# Altium schematic sheet display_dvd_connectors.SchDoc
size A4
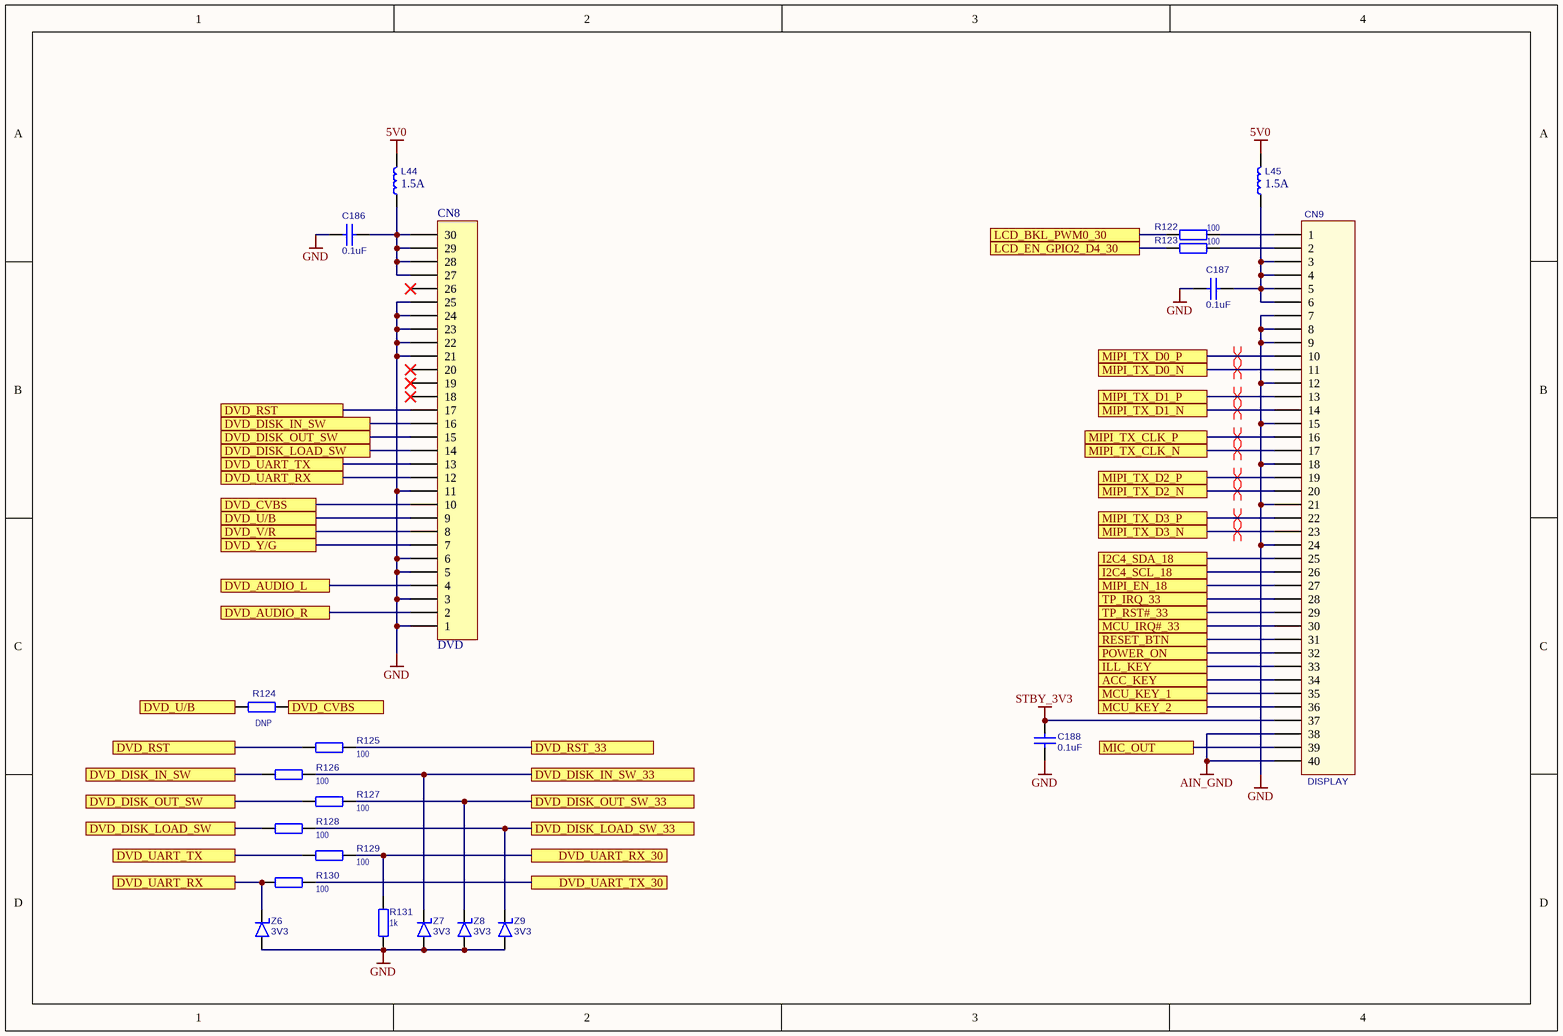
[diagram p0: display_dvd_connectors.SchDoc]

## Parts
C186  value 0.1uF  [C0603]  (hidden comment: C1608X7R1H104K080AA)
C187  value 0.1uF  [C0603]  (hidden comment: C1608X7R1H104K080AA)
C188  value 0.1uF  [C0603]  (hidden comment: C1608X7R1H104K080AA)
CN8  DVD  [30S-0.5SH]
CN9  DISPLAY  [40S-0.5SH]
L44  value 1.5A  [IND1206]  (hidden comment: BLM31PG601SN1L)
L45  value 1.5A  [IND1206]  (hidden comment: BLM31PG601SN1L)
R122  100  [R0603]
R123  100  [R0603]
R124  DNP  [R0603]
R125  100  [R0603]
R126  100  [R0603]
R127  100  [R0603]
R128  100  [R0603]
R129  100  [R0603]
R130  100  [R0603]
R131  1k  [R0603]
Z6  value 3V3  [SOD-323]  (hidden comment: BZX384-C3V3.115)
Z7  value 3V3  [SOD-323]  (hidden comment: BZX384-C3V3.115)
Z8  value 3V3  [SOD-323]  (hidden comment: BZX384-C3V3.115)
Z9  value 3V3  [SOD-323]  (hidden comment: BZX384-C3V3.115)

## Ports
ACC_KEY, DVD_AUDIO_L, DVD_AUDIO_R, DVD_CVBS, DVD_DISK_IN_SW, DVD_DISK_IN_SW_33, DVD_DISK_LOAD_SW, DVD_DISK_LOAD_SW_33, DVD_DISK_OUT_SW, DVD_DISK_OUT_SW_33, DVD_RST, DVD_RST_33, DVD_U/B, DVD_UART_RX, DVD_UART_RX_30, DVD_UART_TX, DVD_UART_TX_30, DVD_V/R, DVD_Y/G, I2C4_SCL_18, I2C4_SDA_18, ILL_KEY, LCD_BKL_PWM0_30, LCD_EN_GPIO2_D4_30, MCU_IRQ#_33, MCU_KEY_1, MCU_KEY_2, MIC_OUT, MIPI_EN_18, MIPI_TX_CLK_N, MIPI_TX_CLK_P, MIPI_TX_D0_N, MIPI_TX_D0_P, MIPI_TX_D1_N, MIPI_TX_D1_P, MIPI_TX_D2_N, MIPI_TX_D2_P, MIPI_TX_D3_N, MIPI_TX_D3_P, POWER_ON, RESET_BTN, TP_IRQ_33, TP_RST#_33

## Nets
5V0: L44.2 L45.2
AIN_GND: CN9.38 CN9.40
GND: C186.1 C187.1 C188.1 CN8.1 CN8.3 CN8.5 CN8.6 CN8.11 CN8.21 CN8.22 CN8.23 CN8.24 CN8.25 CN9.7 CN9.8 CN9.9 CN9.12 CN9.15 CN9.18 CN9.21 CN9.24 R131.2 Z6.1(A) Z7.1(A) Z8.1(A) Z9.1(A)
STBY_3V3: C188.2 CN9.37
ACC_KEY: CN9.34 ; port ACC_KEY
DVD_AUDIO_L: CN8.4 ; port DVD_AUDIO_L
DVD_AUDIO_R: CN8.2 ; port DVD_AUDIO_R
DVD_CVBS: CN8.10 R124.1 ; port DVD_CVBS
DVD_DISK_IN_SW: CN8.16 R126.2 ; port DVD_DISK_IN_SW
DVD_DISK_IN_SW_33: R126.1 Z7.2(K) ; port DVD_DISK_IN_SW_33
DVD_DISK_LOAD_SW: CN8.14 R128.2 ; port DVD_DISK_LOAD_SW
DVD_DISK_LOAD_SW_33: R128.1 Z9.2(K) ; port DVD_DISK_LOAD_SW_33
DVD_DISK_OUT_SW: CN8.15 R127.2 ; port DVD_DISK_OUT_SW
DVD_DISK_OUT_SW_33: R127.1 Z8.2(K) ; port DVD_DISK_OUT_SW_33
DVD_RST: CN8.17 R125.2 ; port DVD_RST
DVD_RST_33: R125.1 ; port DVD_RST_33
DVD_U/B: CN8.9 R124.2 ; port DVD_U/B
DVD_UART_RX: CN8.12 R130.2 Z6.2(K) ; port DVD_UART_RX
DVD_UART_RX_30: R129.1 R131.1 ; port DVD_UART_RX_30
DVD_UART_TX: CN8.13 R129.2 ; port DVD_UART_TX
DVD_UART_TX_30: R130.1 ; port DVD_UART_TX_30
DVD_V/R: CN8.8 ; port DVD_V/R
DVD_Y/G: CN8.7 ; port DVD_Y/G
I2C4_SCL_18: CN9.26 ; port I2C4_SCL_18
I2C4_SDA_18: CN9.25 ; port I2C4_SDA_18
ILL_KEY: CN9.33 ; port ILL_KEY
LCD_BKL_PWM0_30: R122.1 ; port LCD_BKL_PWM0_30
LCD_EN_GPIO2_D4_30: R123.1 ; port LCD_EN_GPIO2_D4_30
MCU_IRQ#_33: CN9.30 ; port MCU_IRQ#_33
MCU_KEY_1: CN9.35 ; port MCU_KEY_1
MCU_KEY_2: CN9.36 ; port MCU_KEY_2
MIC_OUT: CN9.39 ; port MIC_OUT
MIPI_EN_18: CN9.27 ; port MIPI_EN_18
MIPI_TX_CLK_N: CN9.17 ; port MIPI_TX_CLK_N
MIPI_TX_CLK_P: CN9.16 ; port MIPI_TX_CLK_P
MIPI_TX_D0_N: CN9.11 ; port MIPI_TX_D0_N
MIPI_TX_D0_P: CN9.10 ; port MIPI_TX_D0_P
MIPI_TX_D1_N: CN9.14 ; port MIPI_TX_D1_N
MIPI_TX_D1_P: CN9.13 ; port MIPI_TX_D1_P
MIPI_TX_D2_N: CN9.20 ; port MIPI_TX_D2_N
MIPI_TX_D2_P: CN9.19 ; port MIPI_TX_D2_P
MIPI_TX_D3_N: CN9.23 ; port MIPI_TX_D3_N
MIPI_TX_D3_P: CN9.22 ; port MIPI_TX_D3_P
POWER_ON: CN9.32 ; port POWER_ON
RESET_BTN: CN9.31 ; port RESET_BTN
TP_IRQ_33: CN9.28 ; port TP_IRQ_33
TP_RST#_33: CN9.29 ; port TP_RST#_33
NetC186_2: C186.2 CN8.27 CN8.28 CN8.29 CN8.30 L44.1
NetC187_2: C187.2 CN9.3 CN9.4 CN9.5 CN9.6 L45.1
NetCN9_1: CN9.1 R122.2
NetCN9_2: CN9.2 R123.2

Not connected (* = marked no-connect by the designer): CN8 18* 19* 20* 26*

## Layout directives
differential pair: MIPI_TX_CLK_N, MIPI_TX_CLK_P, MIPI_TX_D0_N, MIPI_TX_D0_P, MIPI_TX_D1_N, MIPI_TX_D1_P, MIPI_TX_D2_N, MIPI_TX_D2_P, MIPI_TX_D3_N, MIPI_TX_D3_P

## Library data of the parts
C186-C188 = CAP_NPOL
CN8 = HDR 30: Header, 30-Pin; LatestRevisionDate: 17-Jul-2002; LatestRevisionNote: Re-released for DXP Platform.; Publisher: Altium Limited
CN9 = FH12-40: DT38; Value: *
L44 L45 = IND_WO_IRON
R122-R131 = RESISTOR: RES
  R122 R123 R125-R130: Value: 100
  R124: Value: DNP
  R131: Value: 1k
Z6-Z9 = ZENNER_1: ZENNER